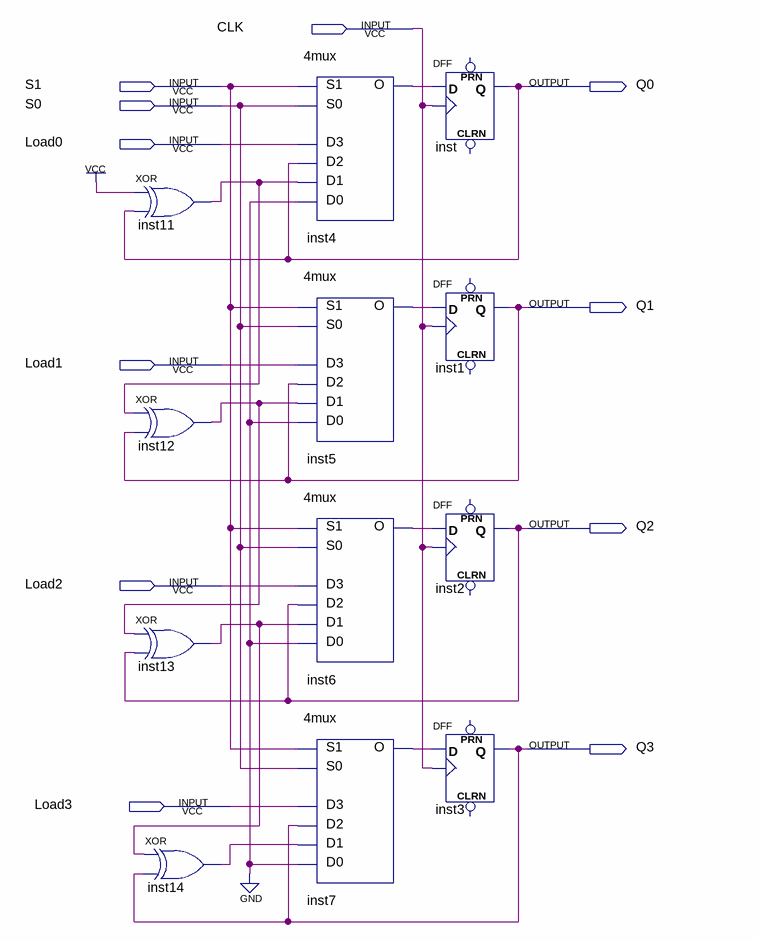
[diagram p0: schematic sheet]
// Quartus schematic hw12p1a.bdf as structural Verilog: 12 symbols, 11 pins
module hw12p1a (
  input  CLK,
  input  S1,
  input  S0,
  input  Load0,
  input  Load1,
  input  Load2,
  input  Load3,
  output Q0,
  output Q1,
  output Q2,
  output Q3
);

  wire inst4_o, inst5_o, inst6_o, inst7_o, inst11_out, inst12_out, inst13_out, inst14_out;

  xor inst11 (inst11_out, 1'b1, Q0);
  xor inst12 (inst12_out, inst11_out, Q1);
  xor inst13 (inst13_out, inst12_out, Q2);
  xor inst14 (inst14_out, inst13_out, Q3);
  \4mux  inst4 (.S1(S1), .S0(S0), .D3(Load0), .D2(Q0), .D1(inst11_out), .D0(1'b0), .O(inst4_o));
  \4mux  inst5 (.S1(S1), .S0(S0), .D3(Load1), .D2(Q1), .D1(inst12_out), .D0(1'b0), .O(inst5_o));
  \4mux  inst6 (.S1(S1), .S0(S0), .D3(Load2), .D2(Q2), .D1(inst13_out), .D0(1'b0), .O(inst6_o));
  \4mux  inst7 (.S1(S1), .S0(S0), .D3(Load3), .D2(Q3), .D1(inst14_out), .D0(1'b0), .O(inst7_o));
  DFF inst (.CLK(CLK), .D(inst4_o), .Q(Q0));  // open: CLRN, PRN
  DFF inst1 (.CLK(CLK), .D(inst5_o), .Q(Q1));  // open: CLRN, PRN
  DFF inst2 (.CLK(CLK), .D(inst6_o), .Q(Q2));  // open: CLRN, PRN
  DFF inst3 (.CLK(CLK), .D(inst7_o), .Q(Q3));  // open: CLRN, PRN
endmodule
